# Altium project Cargas AC ESP32.PrjPcb
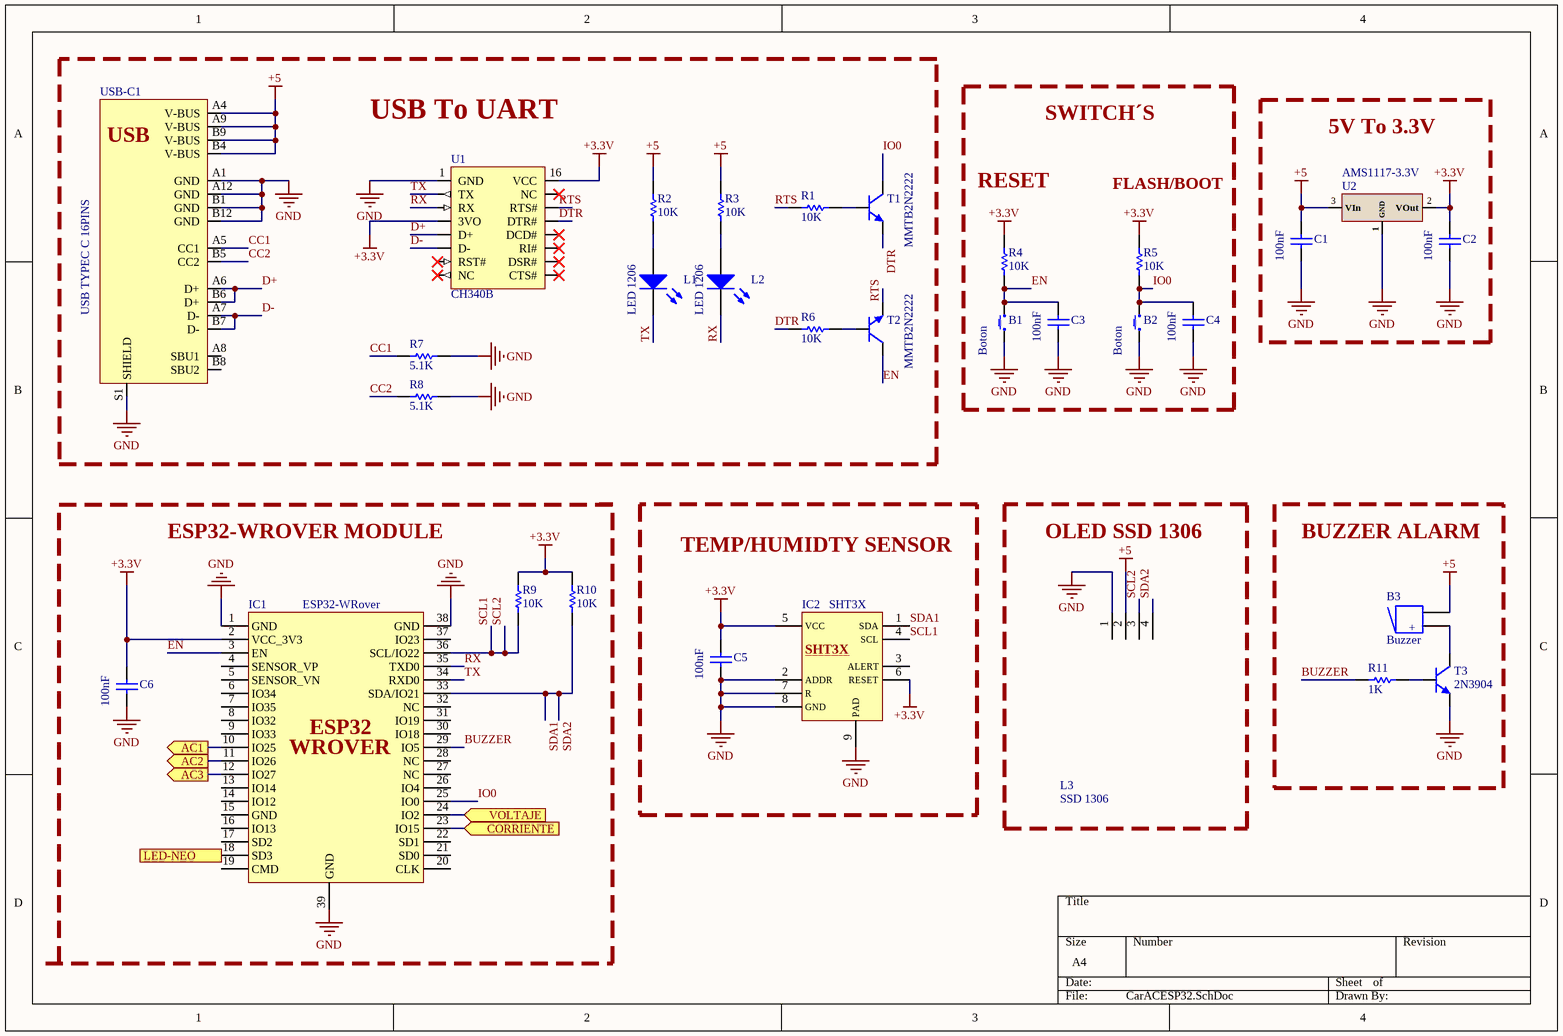
[diagram p0: CarACESP32.SchDoc]
2 sheets, 65 parts. Net scope: flat (ports and power ports of the same name join across sheets).
Board file: CarACESP32.PcbDoc
Sheets:
  CarACESP32.SchDoc
  CarACESP32_2.SchDoc

## Sheet CarACESP32.SchDoc
size A4; SheetNumber: 1; SheetTotal: 2

### Parts
B1  Boton  [Push Boton 2P C]
B2  Boton  [Push Boton 2P C]
B3  Buzzer  [Buzzer]
C1  100nF  [Capacitor 1206]
C2  100nF  [Capacitor 1206]
C3  100nF  [Capacitor 1206]
C4  100nF  [Capacitor 1206]
C5  100nF  [Capacitor 1206]
C6  100nF  [Capacitor 1206]
IC1  ESP32-WRover  [ESP32-WROVER-B]
IC2  SHT3X  [DFN-8_DD]
L1  LED 1206  [LED 1206 G]
L2  LED 1206  [LED 1206 R]
L3  SSD 1306  [OLEDSSD1306]
R1  10K  [Resistencia 1206]
R2  10K  [Resistencia 1206]
R3  10K  [Resistencia 1206]
R4  10K  [Resistencia 1206]
R5  10K  [Resistencia 1206]
R6  10K  [Resistencia 1206]
R7  5.1K  [Resistencia 1206]
R8  5.1K  [Resistencia 1206]
R9  10K  [Resistencia 1206]
R10  10K  [Resistencia 1206]
R11  1K  [Resistencia 1206]
T1  MMTB2N2222  [SOT23_M]
T2  MMTB2N2222  [SOT23_M]
T3  2N3904  [NewTO-92A]
U1  CH340B  [SOIC 16]
U2  AMS1117-3.3V  [SOT 223]
USB-C1  USB TYPEC C 16PINS  [USB-TYPE_C-16]

### Blocks framed on the sheet
USB To UART: L1 L2 R1-R3 R6-R8 T1 T2 U1 USB-C1
5V To 3.3V: C1 C2 U2
TEMP/HUMIDTY SENSOR: C5 IC2
OLED SSD 1306: L3
BUZZER ALARM: B3 R11 T3

### Ports
AC1 (out), AC2 (out), AC3 (out), CORRIENTE (in), LED-NEO (out), VOLTAJE (in)

### Nets
+3.3V: C2.2 C5.2 C6.2 IC1.2(VCC_3V3) IC2.5(VCC) IC2.6(RESET) R4.2(B) R5.2(B) R9.2(B) R10.2(B) U1.4(3VO) U1.16(VCC) U2.2(VOut)
+5: B3.2 C1.2 L3.2 R2.2(B) R3.2(B) U2.3(VIn) USB-C1.A4(V-BUS) USB-C1.A9(V-BUS) USB-C1.B4(V-BUS) USB-C1.B9(V-BUS)
GND: B1.1 B2.1 C1.1 C2.1 C3.1 C4.1 C5.1 C6.1 IC1.1(GND) IC1.38(GND) IC1.39(GND) IC2.2(ADDR) IC2.7(R) IC2.8(GND) IC2.9(PAD) L3.1 R7.1(A) R8.1(A) T3.1(E) U1.1(GND) U2.1(GND) USB-C1.A1(GND) USB-C1.A12(GND) USB-C1.B1(GND) USB-C1.B12(GND) USB-C1.S1(SHIELD)
BUZZER: IC1.29(IO5) R11.2(B)
CC1: R7.2(B) USB-C1.A5(CC1)
CC2: R8.2(B) USB-C1.B5(CC2)
D+: U1.5(D+) USB-C1.A6(D+) USB-C1.B6(D+)
D-: U1.6(D-) USB-C1.A7(D-) USB-C1.B7(D-)
DTR: R6.2(B) T1.2(E) U1.13(DTR#)
EN: B1.2 C3.2 IC1.3(EN) R4.1(A) T2.3(C)
IO0: B2.2 C4.2 IC1.25(IO0) R5.1(A) T1.3(C)
RTS: R1.2(B) T2.2(E) U1.14(RTS#)
RX: IC1.35(TXD0) L2.2(K) U1.3(RX)
SCL1: IC1.36(SCL/IO22) IC2.4(SCL) L3.3 R9.1(A)  [also labelled SCL2]
SDA1: IC1.33(SDA/IO21) IC2.1(SDA) L3.4 R10.1(A)  [also labelled SDA2]
TX: IC1.34(RXD0) L1.2(K) U1.2(TX)
NetB3_1: B3.1 T3.3(C)
NetIC1_10: IC1.10(IO25) ; port AC1
NetIC1_11: IC1.11(IO26) ; port AC2
NetIC1_12: IC1.12(IO27) ; port AC3
NetIC1_18: IC1.18(SD3) ; port LED-NEO
NetIC1_23: IC1.23(IO15) ; port CORRIENTE
NetIC1_24: IC1.24(IO2) ; port VOLTAJE
NetL1_1: L1.1(A) R2.1(A)
NetL2_1: L2.1(A) R3.1(A)
NetR1_1: R1.1(A) T1.1(B)
NetR6_1: R6.1(A) T2.1(B)
NetR11_1: R11.1(A) T3.2(B)

Not connected (* = marked no-connect by the designer): IC1 4(SENSOR_VP) 5(SENSOR_VN) 6(IO34) 7(IO35) 8(IO32) 9(IO33) 13(IO14) 14(IO12) 15(GND) 16(IO13) 17(SD2) 19(CMD) 20(CLK) 21(SD0) 22(SD1) 26(IO4) 27(NC) 28(NC) 30(IO18) 31(IO19) 32(NC) 37(IO23); IC2 3(ALERT); U1 7(RST#)* 8(NC)* 9(CTS#)* 10(DSR#)* 11(RI#)* 12(DCD#)* 15(NC)*; USB-C1 A8(SBU1) B8(SBU2)

### Notes on the sheet
- SWITCH´S
- RESET
- FLASH/BOOT
- ESP32-WROVER MODULE
- (in symbol Buzzer) +
- (in symbol ESP32-WRover) ESP32; WROVER
- (in symbol USB TYPEC C 16PINS) USB

### Library data of the parts
B1 B2 = Push Boton 2 Pin TH: Micro Push TH
B3 = Buzzer: Active Sound
C1-C6 = Capacitor 1206: Capacitor cerámico 1206 SMD
IC1 = ESP32-WRover: ESP32-WRover 39Pins
L1 L2 = LED 1206: LED SMD 1206
L3 = SSD 1306: Pantalla OLED 124x64
R1-R11 = Resistencia SMD 1206
T1 T2 = MMBT2N2222A
U1 = CH340B: USB-Serial Converter
U2 = AMS1117: Regulador Lineal de Voltaje
USB-C1 = USB TYPEC C 16PINS: USB Type C 16 Pins

## Sheet CarACESP32_2.SchDoc
size A4; SheetNumber: 2; SheetTotal: 2
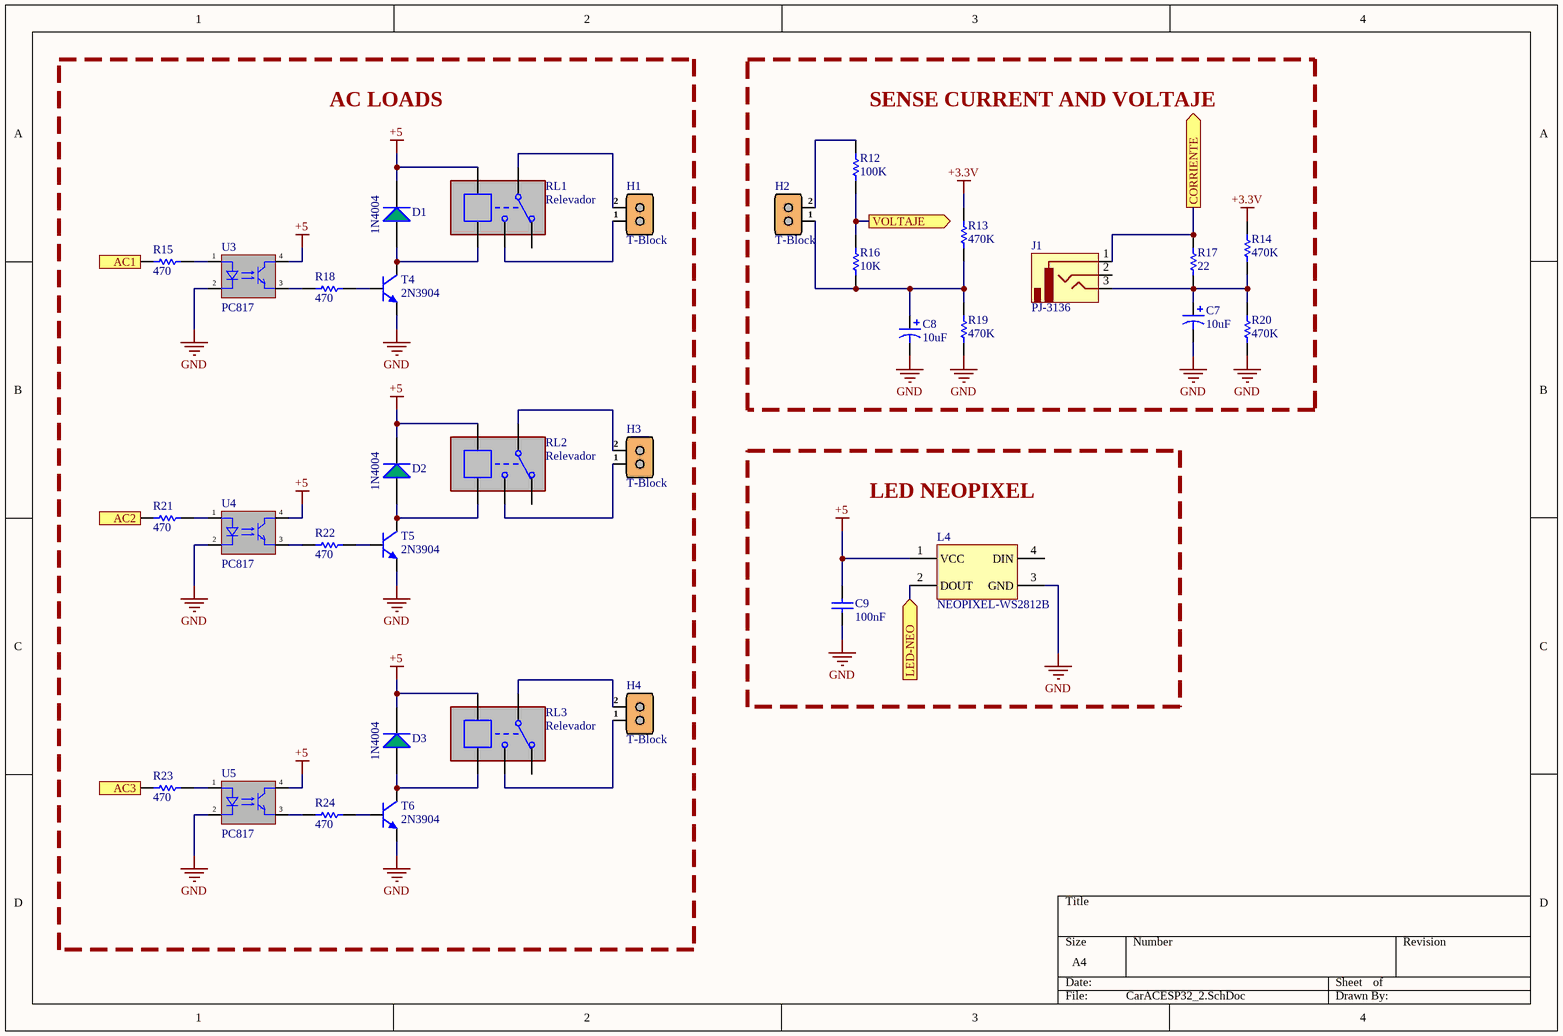
[diagram p1: CarACESP32_2.SchDoc]

### Parts
C7  10uF  [100uF]
C8  10uF  [100uF]
C9  100nF  [Capacitor 1206]
D1  1N4004  [1N4007 SMD]
D2  1N4004  [1N4007 SMD]
D3  1N4004  [1N4007 SMD]
H1  T-Block  [TBLOCK-2ORANGE]
H2  T-Block  [TBLOCK-2ORANGE]
H3  T-Block  [TBLOCK-2ORANGE]
H4  T-Block  [TBLOCK-2ORANGE]
J1  PJ-3136  [PJ-3136-X]
L4  NEOPIXEL-WS2812B  [WS2812B]
R12  100K  [Resistencia 1206]
R13  470K  [Resistencia 1206]
R14  470K  [Resistencia 1206]
R15  470  [Resistencia 1206]
R16  10K  [Resistencia 1206]
R17  22  [Resistencia 1206]
R18  470  [Resistencia 1206]
R19  470K  [Resistencia 1206]
R20  470K  [Resistencia 1206]
R21  470  [Resistencia 1206]
R22  470  [Resistencia 1206]
R23  470  [Resistencia 1206]
R24  470  [Resistencia 1206]
RL1  Relevador  [Relevador Mini 20A]
RL2  Relevador  [Relevador Mini 20A]
RL3  Relevador  [Relevador Mini 20A]
T4  2N3904  [SOT23_M]
T5  2N3904  [SOT23_M]
T6  2N3904  [SOT23_M]
U3  PC817  [PC817]
U4  PC817  [PC817]
U5  PC817  [PC817]

### Blocks framed on the sheet
AC LOADS: D1-D3 H1 H3 H4 R15 R18 R21-R24 RL1-RL3 T4-T6 U3-U5
SENSE CURRENT AND VOLTAJE: C7 C8 H2 J1 R12-R14 R16 R17 R19 R20
LED NEOPIXEL: C9 L4

### Ports
AC1 (in), AC2 (in), AC3 (in), CORRIENTE (out), LED-NEO (in), VOLTAJE (out)

### Nets
+3.3V: R13.2(B) R14.2(B)
+5: C9.2 D1.2(C) D2.2(C) D3.2(C) L4.1(VCC) RL1.1 RL2.1 RL3.1 U3.4(C) U4.4(C) U5.4(C)
GND: C7.2 C8.2 C9.1 L4.3(GND) R19.1(A) R20.1(A) T4.2(E) T5.2(E) T6.2(E) U3.2(K) U4.2(K) U5.2(K)
NetC7_1: C7.1 J1.3 R14.1(A) R17.1(A) R20.2(B)
NetC8_1: C8.1 H2.1 R13.1(A) R16.1(A) R19.2(B)
NetD1_1: D1.1(A) RL1.2 T4.3(C)
NetD2_1: D2.1(A) RL2.2 T5.3(C)
NetD3_1: D3.1(A) RL3.2 T6.3(C)
NetH1_1: H1.1 RL1.4
NetH1_2: H1.2 RL1.3
NetH2_2: H2.2 R12.2(B)
NetH3_1: H3.1 RL2.4
NetH3_2: H3.2 RL2.3
NetH4_1: H4.1 RL3.4
NetH4_2: H4.2 RL3.3
NetIC1_10: R15.2(B) ; port AC1
NetIC1_11: R21.2(B) ; port AC2
NetIC1_12: R23.2(B) ; port AC3
NetIC1_18: L4.2(DOUT) ; port LED-NEO
NetIC1_23: J1.1 R17.2(B) ; port CORRIENTE
NetIC1_24: R12.1(A) R16.2(B) ; port VOLTAJE
NetR15_1: R15.1(A) U3.1(A)
NetR18_1: R18.1(A) T4.1(B)
NetR18_2: R18.2(B) U3.3(E)
NetR21_1: R21.1(A) U4.1(A)
NetR22_1: R22.1(A) T5.1(B)
NetR22_2: R22.2(B) U4.3(E)
NetR23_1: R23.1(A) U5.1(A)
NetR24_1: R24.1(A) T6.1(B)
NetR24_2: R24.2(B) U5.3(E)

Not connected (* = marked no-connect by the designer): J1 2; L4 4(DIN); RL1 5; RL2 5; RL3 5

### Library data of the parts
C7 C8 = CAP-ELEC-100uF
C9 = Capacitor 1206: Capacitor cerámico 1206 SMD
D1-D3 = 1N4007 SMD: Diodo Rectificador
H1-H4 = T-Block 5.08mm 2P: Terminal de Bloque 2P 5.08mm
J1 = JACK HEMBRA 3.5MM: PJ-3136 Jack De Audio Hembra
L4 = NEOPIXEL-WS2812B: LED NEOPIXEL WS2812B
R12-R24 = Resistencia SMD 1206
RL1-RL3 = Relevador S 5V 20A: Relevador Mini
T4-T6 = MMBT2N3904
U3-U5 = PC817: Optoacoplador NPN

## Nets that join several sheets
+3.3V: CarACESP32 (13 pins), CarACESP32_2 (R13.2 R14.2)
+5: CarACESP32 (10 pins), CarACESP32_2 (11 pins)
GND: CarACESP32 (26 pins), CarACESP32_2 (12 pins)
NetIC1_10: CarACESP32 (IC1.10), CarACESP32_2 (R15.2)
NetIC1_11: CarACESP32 (IC1.11), CarACESP32_2 (R21.2)
NetIC1_12: CarACESP32 (IC1.12), CarACESP32_2 (R23.2)
NetIC1_18: CarACESP32 (IC1.18), CarACESP32_2 (L4.2)
NetIC1_23: CarACESP32 (IC1.23), CarACESP32_2 (J1.1 R17.2)
NetIC1_24: CarACESP32 (IC1.24), CarACESP32_2 (R12.1 R16.2)